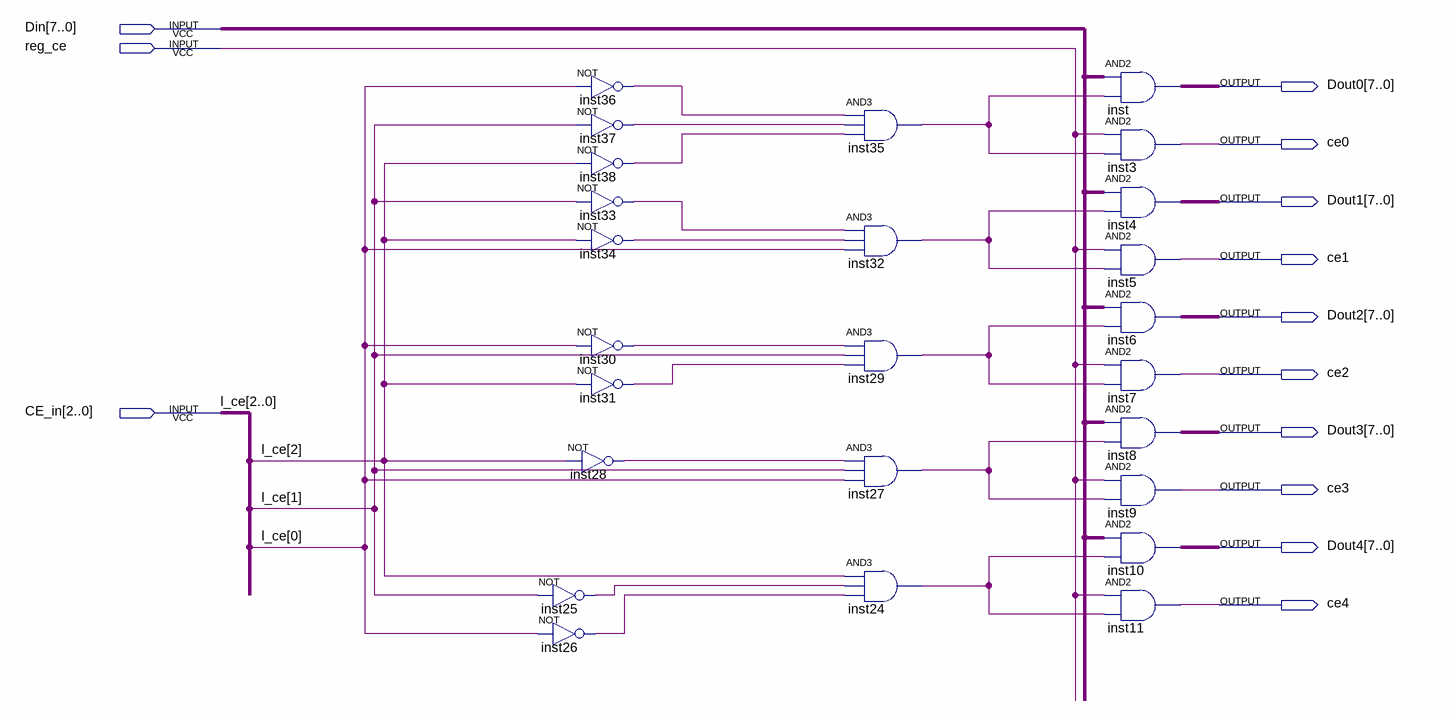
[diagram p0: schematic sheet]
// Quartus schematic demux_5.bdf as structural Verilog: 25 symbols, 13 pins
module demux_5 (
  input  [7:0] Din,
  input  reg_ce,
  input  [2:0] CE_in,
  output [7:0] Dout0,
  output ce0,
  output [7:0] Dout1,
  output ce1,
  output [7:0] Dout2,
  output ce2,
  output [7:0] Dout3,
  output ce3,
  output [7:0] Dout4,
  output ce4
);

  wire inst24_out, inst25_out, inst26_out, inst27_out, inst28_out, inst29_out, inst30_out, inst31_out,
       inst32_out, inst33_out, inst34_out, inst35_out, inst36_out, inst37_out, inst38_out;

  not inst25 (inst25_out, CE_in[1]);
  not inst26 (inst26_out, CE_in[0]);
  not inst36 (inst36_out, CE_in[0]);
  not inst37 (inst37_out, CE_in[1]);
  not inst38 (inst38_out, CE_in[2]);
  not inst33 (inst33_out, CE_in[1]);
  not inst34 (inst34_out, CE_in[2]);
  not inst30 (inst30_out, CE_in[0]);
  not inst31 (inst31_out, CE_in[2]);
  not inst28 (inst28_out, CE_in[2]);
  and inst35 (inst35_out, inst36_out, inst37_out, inst38_out);
  and inst32 (inst32_out, inst33_out, inst34_out, CE_in[0]);
  and inst29 (inst29_out, inst30_out, CE_in[1], inst31_out);
  and inst27 (inst27_out, inst28_out, CE_in[1], CE_in[0]);
  and inst24 (inst24_out, CE_in[2], inst25_out, inst26_out);
  assign Dout0 = Din & {8{inst35_out}};  // AND2 inst, 8 bits wide
  and inst3 (ce0, reg_ce, inst35_out);
  assign Dout1 = Din & {8{inst32_out}};  // AND2 inst4, 8 bits wide
  and inst5 (ce1, reg_ce, inst32_out);
  assign Dout2 = Din & {8{inst29_out}};  // AND2 inst6, 8 bits wide
  and inst7 (ce2, reg_ce, inst29_out);
  assign Dout3 = Din & {8{inst27_out}};  // AND2 inst8, 8 bits wide
  and inst9 (ce3, reg_ce, inst27_out);
  assign Dout4 = Din & {8{inst24_out}};  // AND2 inst10, 8 bits wide
  and inst11 (ce4, reg_ce, inst24_out);

  // Other names for the same wires on the sheet: l_ce[2:0] = CE_in
endmodule
